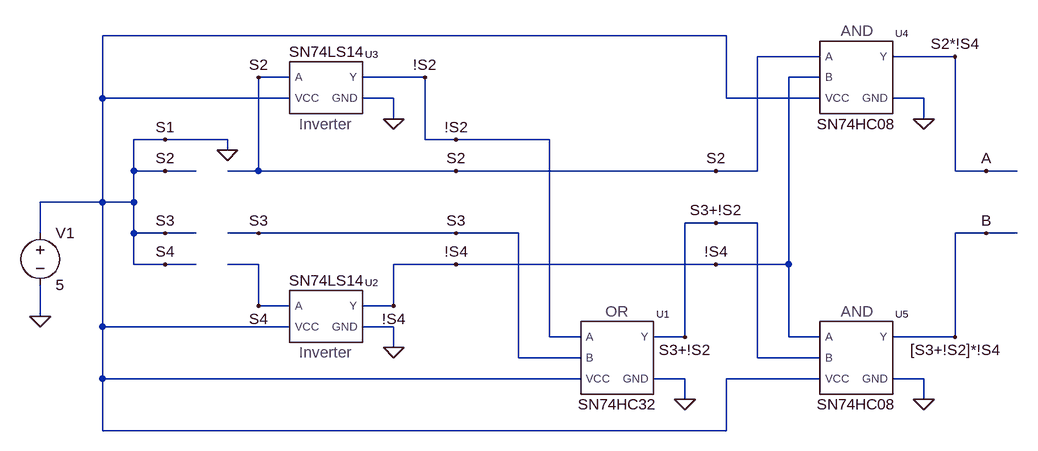
[diagram p0: schematic Proyecto.asc]
Proyecto.asc, the LTspice schematic file:
Version 4.1
SHEET 1 1568 680
WIRE 992 -48 32 -48
WIRE 1136 -16 1040 -16
WIRE 1344 -16 1248 -16
WIRE 320 16 272 16
WIRE 528 16 432 16
WIRE 1136 16 1088 16
WIRE 32 48 32 -48
WIRE 320 48 32 48
WIRE 480 48 432 48
WIRE 992 48 992 -48
WIRE 1136 48 992 48
WIRE 1296 48 1248 48
WIRE 480 80 480 48
WIRE 1296 80 1296 48
WIRE 128 112 80 112
WIRE 224 112 128 112
WIRE 528 112 528 16
WIRE 576 112 528 112
WIRE 720 112 576 112
WIRE 224 128 224 112
WIRE 80 160 80 112
WIRE 128 160 80 160
WIRE 176 160 128 160
WIRE 272 160 272 16
WIRE 272 160 224 160
WIRE 576 160 272 160
WIRE 976 160 576 160
WIRE 1040 160 1040 -16
WIRE 1040 160 976 160
WIRE 1344 160 1344 -16
WIRE 1392 160 1344 160
WIRE 1440 160 1392 160
WIRE 32 208 32 48
WIRE 32 208 -64 208
WIRE 80 208 80 160
WIRE 80 208 32 208
WIRE 976 240 928 240
WIRE 1040 240 976 240
WIRE -64 256 -64 208
WIRE 80 256 80 208
WIRE 128 256 80 256
WIRE 176 256 128 256
WIRE 272 256 224 256
WIRE 576 256 272 256
WIRE 672 256 576 256
WIRE 1392 256 1344 256
WIRE 1440 256 1392 256
WIRE 80 304 80 256
WIRE 128 304 80 304
WIRE 176 304 128 304
WIRE 272 304 224 304
WIRE 576 304 480 304
WIRE 976 304 576 304
WIRE 1088 304 1088 16
WIRE 1088 304 976 304
WIRE 272 368 272 304
WIRE 320 368 272 368
WIRE 480 368 480 304
WIRE 480 368 432 368
WIRE -64 384 -64 336
WIRE 32 400 32 208
WIRE 320 400 32 400
WIRE 480 400 432 400
WIRE 720 416 720 112
WIRE 768 416 720 416
WIRE 928 416 928 240
WIRE 928 416 880 416
WIRE 1088 416 1088 304
WIRE 1136 416 1088 416
WIRE 1344 416 1344 256
WIRE 1344 416 1248 416
WIRE 480 432 480 400
WIRE 672 448 672 256
WIRE 768 448 672 448
WIRE 1040 448 1040 240
WIRE 1136 448 1040 448
WIRE 32 480 32 400
WIRE 768 480 32 480
WIRE 928 480 880 480
WIRE 1136 480 992 480
WIRE 1296 480 1248 480
WIRE 928 512 928 480
WIRE 1296 512 1296 480
WIRE 32 560 32 480
WIRE 992 560 992 480
WIRE 992 560 32 560
FLAG -64 384 0
FLAG 128 112 S1
FLAG 128 160 S2
FLAG 128 256 S3
FLAG 128 304 S4
FLAG 224 128 0
FLAG 272 16 S2
FLAG 528 16 !S2
FLAG 272 256 S3
FLAG 576 256 S3
FLAG 272 368 S4
FLAG 480 368 !S4
FLAG 480 432 0
FLAG 480 80 0
FLAG 576 160 S2
FLAG 576 112 !S2
FLAG 576 304 !S4
FLAG 976 240 S3+!S2
FLAG 976 160 S2
FLAG 976 304 !S4
FLAG 928 416 S3+!S2
FLAG 928 512 0
FLAG 1296 80 0
FLAG 1296 512 0
FLAG 1344 -16 S2*!S4
FLAG 1344 416 [S3+!S2]*!S4
FLAG 1392 160 A
FLAG 1392 256 B
SYMBOL voltage -64 240 R0
WINDOW 123 0 0 Left 0
WINDOW 39 0 0 Left 0
SYMATTR InstName V1
SYMATTR Value 5
SYMBOL INV-SN74LS14 368 384 R0
SYMATTR InstName U2
SYMBOL INV-SN74LS14 368 32 R0
SYMATTR InstName U3
SYMBOL OR-SN74HC32 816 448 R0
SYMATTR InstName U1
SYMBOL AND-SN74HC08 1184 16 R0
SYMATTR InstName U4
SYMBOL AND-SN74HC08 1184 448 R0
SYMATTR InstName U5

The netlist it stands for:
* Proyecto.asc
V1 0 0 5
X§U2 !S4 0 0 0 SN74LS14  ; pins Y A VCC GND
X§U3 !S2 0 0 0 SN74LS14  ; pins Y A VCC GND
X§U1 S3+!S2 !S2 0 0 0 SN74HC32  ; pins Y A B VCC GND
X§U4 A 0 !S4 0 0 SN74HC08  ; pins Y A B VCC GND
X§U5 B !S4 S3+!S2 0 0 SN74HC08  ; pins Y A B VCC GND
.lib C:\Users\josea\Downloads\sdlm046\SN74LS14.cir
.lib C:\Users\josea\OneDrive\Escritorio\Andres\TEC\2025_SemestreI\Fundamentos de arquitectura de computadores\Proyecto\OR-SN74HC32.cir
.lib C:\Users\josea\OneDrive\Escritorio\Andres\TEC\2025_SemestreI\Fundamentos de arquitectura de computadores\Proyecto\AND-SN74HC08.cir
.backanno
.end